# Altium schematic sheet button_led.SchDoc
size A4
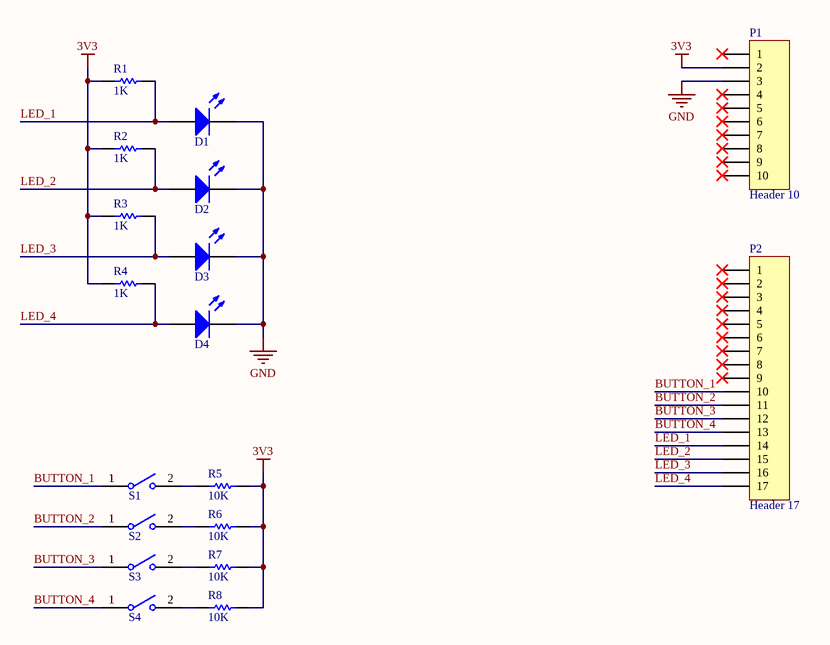
[diagram p0: button_led.SchDoc]

## Parts
D1  LED  [0603_YELLOW]  (value not drawn)
D2  LED  [0603_YELLOW]  (value not drawn)
D3  LED  [0603_YELLOW]  (value not drawn)
D4  LED  [0603_YELLOW]  (value not drawn)
P1  Header 10  [HDR1X10]
P2  Header 17  [HDR1X17]
R1  value 1K  [RC0603N]  (hidden comment: RES)
R2  value 1K  [RC0603N]  (hidden comment: RES)
R3  value 1K  [RC0603N]  (hidden comment: RES)
R4  value 1K  [RC0603N]  (hidden comment: RES)
R5  value 10K  [RC0603N]  (hidden comment: RES)
R6  value 10K  [RC0603N]  (hidden comment: RES)
R7  value 10K  [RC0603N]  (hidden comment: RES)
R8  value 10K  [RC0603N]  (hidden comment: RES)
S1  Tact Switch SPST  [TS_SPST_W4.5XD4.5]  (value not drawn)
S2  Tact Switch SPST  [TS_SPST_W4.5XD4.5]  (value not drawn)
S3  Tact Switch SPST  [TS_SPST_W4.5XD4.5]  (value not drawn)
S4  Tact Switch SPST  [TS_SPST_W4.5XD4.5]  (value not drawn)

## Nets
3V3: P1.2 R1.2 R2.2 R3.2 R4.2 R5.1 R6.1 R7.1 R8.1
GND: D1.2(K) D2.2(K) D3.2(K) D4.2(K) P1.3
BUTTON_1: P2.10 S1.1
BUTTON_2: P2.11 S2.1
BUTTON_3: P2.12 S3.1
BUTTON_4: P2.13 S4.1
LED_1: D1.1(A) P2.14 R1.1
LED_2: D2.1(A) P2.15 R2.1
LED_3: D3.1(A) P2.16 R3.1
LED_4: D4.1(A) P2.17 R4.1
NetR5_2: R5.2 S1.2
NetR6_2: R6.2 S2.2
NetR7_2: R7.2 S3.2
NetR8_2: R8.2 S4.2

Not connected (* = marked no-connect by the designer): P1 1* 4* 5* 6* 7* 8* 9* 10*; P2 1* 2* 3* 4* 5* 6* 7* 8* 9*

## Library data of the parts
D1-D4 = LED: LED Emitters; ForwardVoltage: 2V
P1 = Header 10: Header, 10-Pin; LatestRevisionDate: 17-Jul-2002; LatestRevisionNote: Re-released for DXP Platform.; Publisher: Altium Limited
P2 = Header 17: Header, 17-Pin; LatestRevisionDate: 17-Jul-2002; LatestRevisionNote: Re-released for DXP Platform.; Publisher: Altium Limited
R1-R8 = RES: Chip Resistors; PowerRating: 0.25W
S1-S4 = Tact Switch SPST: Switch